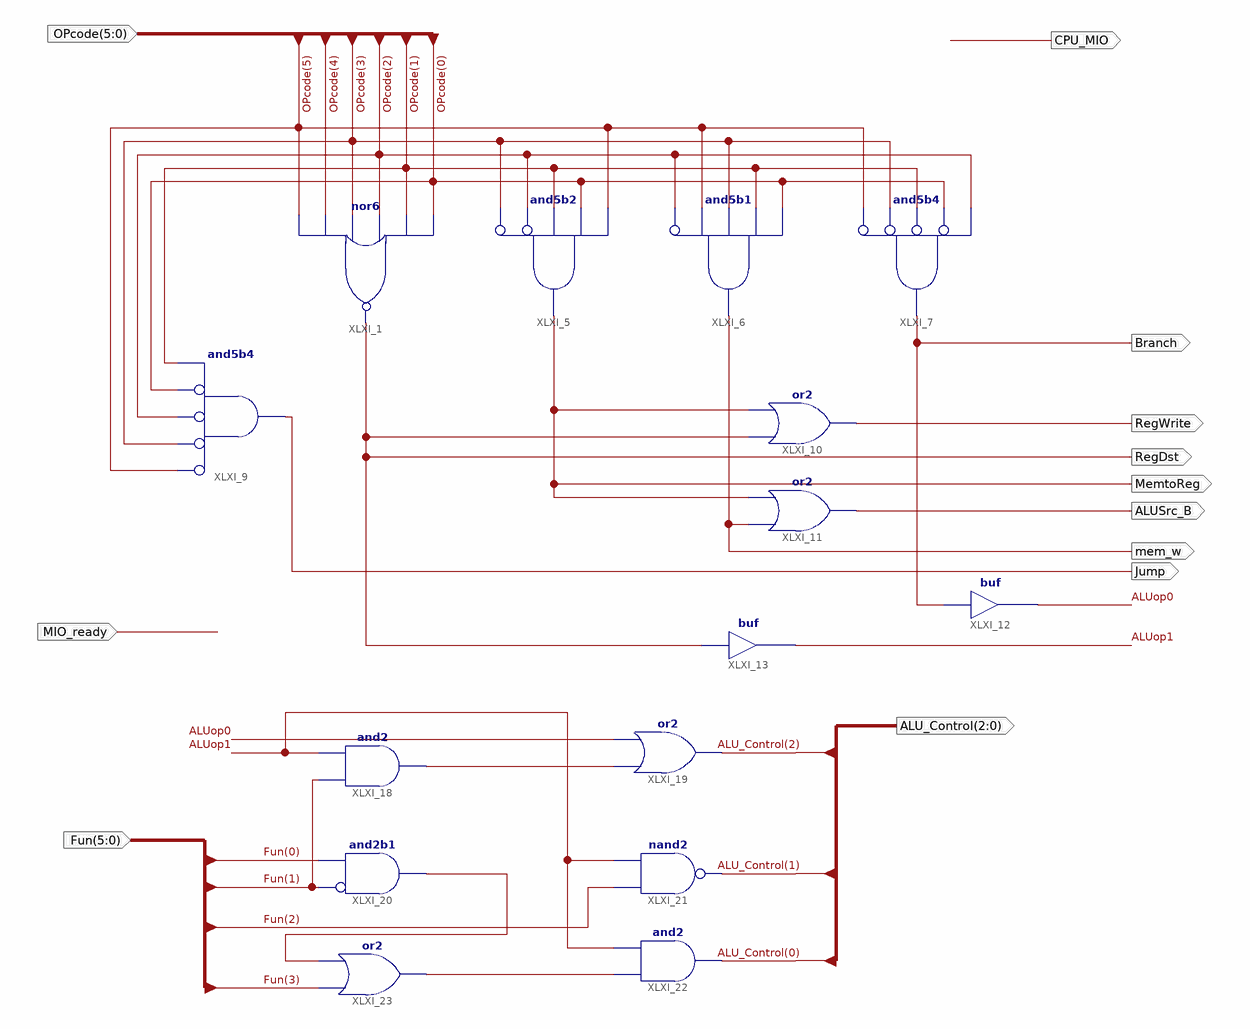
[diagram p0: schematic sheet 1]
// Xilinx ISE schematic SCPU_ctrl.sch (kintex7) as structural Verilog: 15 symbols, 12 ports
module SCPU_ctrl (
  input  [5:0] OPcode,
  input  MIO_ready,
  input  [5:0] Fun,
  output RegDst,
  output MemtoReg,
  output mem_w,
  output Branch,
  output RegWrite,
  output ALUSrc_B,
  output [2:0] ALU_Control,
  output Jump,
  output CPU_MIO
);

  wire ALUop0, ALUop1, XLXN_48, XLXN_55, XLXN_57;

  nor XLXI_1 (RegDst, OPcode[5], OPcode[4], OPcode[3], OPcode[2], OPcode[1], OPcode[0]);
  and XLXI_5 (MemtoReg, ~OPcode[3], ~OPcode[2], OPcode[1], OPcode[0], OPcode[5]);  // and5b2
  and XLXI_6 (mem_w, ~OPcode[2], OPcode[5], OPcode[3], OPcode[1], OPcode[0]);  // and5b1
  and XLXI_7 (Branch, ~OPcode[5], ~OPcode[3], ~OPcode[1], ~OPcode[0], OPcode[2]);  // and5b4
  and XLXI_9 (Jump, ~OPcode[5], ~OPcode[3], ~OPcode[2], ~OPcode[0], OPcode[1]);  // and5b4
  buf XLXI_12 (ALUop0, Branch);
  buf XLXI_13 (ALUop1, RegDst);
  or XLXI_10 (RegWrite, RegDst, MemtoReg);
  or XLXI_11 (ALUSrc_B, mem_w, MemtoReg);
  and XLXI_18 (XLXN_48, Fun[1], ALUop1);
  or XLXI_19 (ALU_Control[2], XLXN_48, ALUop0);
  and XLXI_20 (XLXN_55, ~Fun[1], Fun[0]);  // and2b1
  nand XLXI_21 (ALU_Control[1], Fun[2], ALUop1);
  and XLXI_22 (ALU_Control[0], XLXN_57, ALUop1);
  or XLXI_23 (XLXN_57, Fun[3], XLXN_55);
endmodule
